# Altium project DM2097_R0M0E0.PrjPcb (part 2 of 4)

## Sheet DM2097_RJ45.SchDoc: =project_title
size Tabloid; CompanyName: Luxonis Holding; DrawnBy: David Malovrh; Organization: Luxonis Holding; Address1: 1925 Harmony Park Drive; Address2: Westminster, CO; Address3: 80234; Address4: United States; DocumentNumber: D0000200; Revision: R0M0E0; SheetNumber: 8; SheetTotal: 12
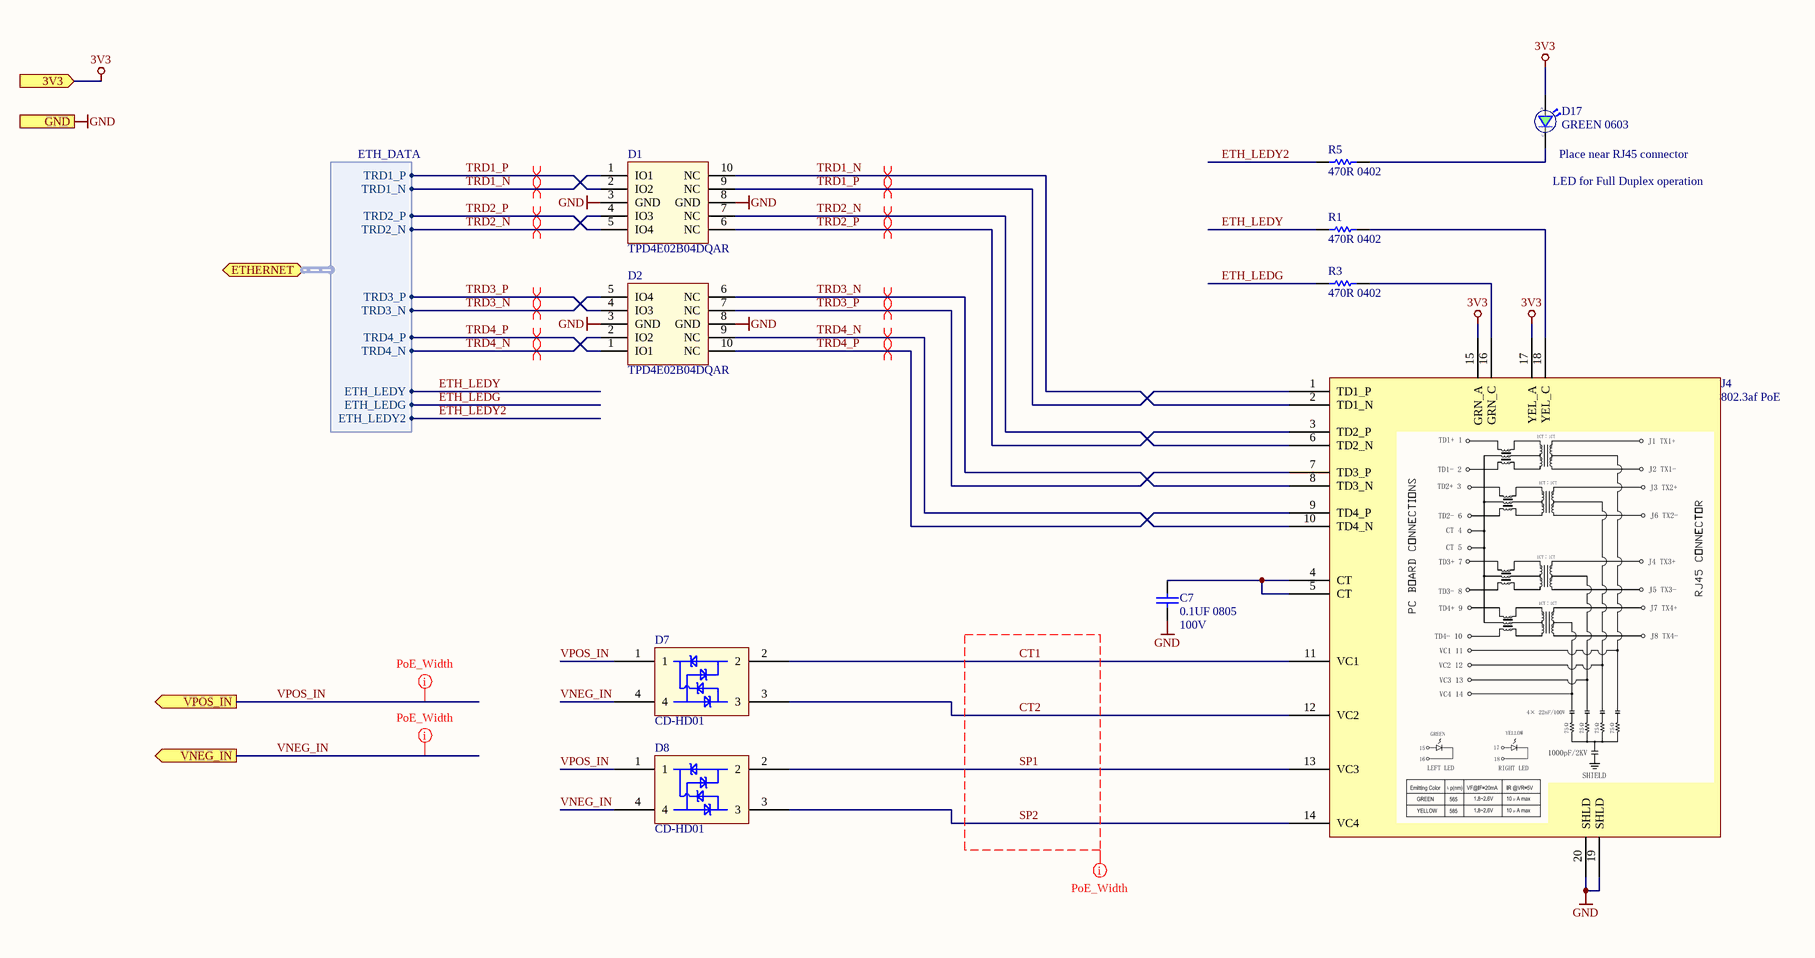
[diagram p3: DM2097_RJ45.SchDoc]

### Parts
C7  0.1UF 0805  Voltage Rating: 100V  [CAPC0805(2012)145_N]
D1  TPD4E02B04DQAR  [TPD4E02B04DQAR]
D2  TPD4E02B04DQAR  [TPD4E02B04DQAR]
D7  CD-HD01  [CD-H01]
D8  CD-HD01  [CD-H01]
D17  GREEN 0603  [SML_D1xx8W]
J4  802.3af PoE  [TRJG0926HENL]
R1  470R 0402  [RESC0402(1005)_N]
R3  470R 0402  [RESC0402(1005)_N]
R5  470R 0402  [RESC0402(1005)_N]

### Ports
3V3 (in), ETHERNET (bidir, harness ETH_DATA), GND (in), VNEG_IN (out), VPOS_IN (out)

### Harnesses
ETH_DATA: TRD1_P, TRD1_N, TRD2_P, TRD2_N, TRD3_P, TRD3_N, TRD4_P, TRD4_N, ETH_LEDG, ETH_LEDY, ETH_LEDY2

### Nets
3V3: D17.2(A) J4.15(GRN_A) J4.17(YEL_A) ; port 3V3
GND: C7.1 D1.3(GND) D1.8(GND) D2.3(GND) D2.8(GND) J4.19(SHLD) J4.20(SHLD) ; port GND
CT1: D7.2 J4.11(VC1)
CT2: D7.3 J4.12(VC2)
ETH_LEDG: R3.1 ; port ETHERNET.ETH_LEDG
ETH_LEDY: R1.1 ; port ETHERNET.ETH_LEDY
ETH_LEDY2: R5.1 ; port ETHERNET.ETH_LEDY2
SP1: D8.2 J4.13(VC3)
SP2: D8.3 J4.14(VC4)
TRD1_N: D1.1(IO1) D1.10(NC) J4.2(TD1_N) ; port ETHERNET.TRD1_N
TRD1_P: D1.2(IO2) D1.9(NC) J4.1(TD1_P) ; port ETHERNET.TRD1_P
TRD2_N: D1.4(IO3) D1.7(NC) J4.6(TD2_N) ; port ETHERNET.TRD2_N
TRD2_P: D1.5(IO4) D1.6(NC) J4.3(TD2_P) ; port ETHERNET.TRD2_P
TRD3_N: D2.5(IO4) D2.6(NC) J4.8(TD3_N) ; port ETHERNET.TRD3_N
TRD3_P: D2.4(IO3) D2.7(NC) J4.7(TD3_P) ; port ETHERNET.TRD3_P
TRD4_N: D2.2(IO2) D2.9(NC) J4.10(TD4_N) ; port ETHERNET.TRD4_N
TRD4_P: D2.1(IO1) D2.10(NC) J4.9(TD4_P) ; port ETHERNET.TRD4_P
VNEG_IN: D7.4 D8.4 ; port VNEG_IN
VPOS_IN: D7.1 D8.1 ; port VPOS_IN
NetC7_2: C7.2 J4.4(CT) J4.5(CT)
NetD17_1: D17.1(C) R5.2
NetJ4_16: J4.16(GRN_C) R3.2
NetJ4_18: J4.18(YEL_C) R1.2

### Layout directives
differential pair; net class ETH; differential pair class 100ohm: TRD1_N, TRD1_P, TRD2_N, TRD2_P, TRD3_N, TRD3_P, TRD4_N, TRD4_P
net class PoE_SELV: CT1, CT2, SP1, SP2
rule Width Constraint [Pref Width = 15mil    Min Width = 4mil    Max Width = 50mil]; net class PoE: VNEG_IN, VPOS_IN

### Notes on the sheet
- (near D17) Place near RJ45 connector
- (near D17) LED for Full Duplex operation
- Title
- Size:
- Date:
- Tabloid
- Number:
- Time:
- Revision:
- Sheet
- of
- Drawn by:

### Library data of the parts
C7 = CL21B104KCFNNNE: CAP CER 0.1UF 100V X7R 0805; Manufacturer 1: Samsung; Tolerance: 10%; Capacitance: 100nF; Supplier 1: Digi-Key; Manufacturer Part Number 1: CL21B104KCFNNNE; Stock 1: 93036; Pricing 1: 1=0.10000, 10=0.06800, 100=0.03050, 500=0.02180, 1000=0.01712 (USD); RoHS: Yes; Mount: Surface Mount; Case/Package: 0805; Case Code (Metric): 2012; Case Code (Imperial): 0805; Min Operating Temperature: -55°C; Max Operating Temperature: 125°C; Packaging: Tape and Reel; Dielectric: X7R; Length: 2mm; Width: 0.049inch; Thickness: 0.053inch; Depth: 1.25mm; Radiation Hardening: No; ComponentLink1URL: https://datasheet.ciiva.com/26936/getdatasheetpartid-781823-26936904.pdf?src-supplier=Verical; ComponentLink1Description: https://datasheet.ciiva.com/26936/getdatasheetpartid-781823-26936904.pdf?src-supplier=Verical; Supplier 2: Newark; Supplier 3: Future Electronics; Supplier Part Number 3: CL21B104KCFNNNE-CUTT; Supplier Part Number 2: 82AC9430; Supplier Part Number 1: 1276-6840-1-ND
D1 D2 = TPD4E02B04DQAR: TVS DIODE 3.6V 8.8V 10USON 8.8V (Typ) Clamp 5A (8/20µs) Ipp Tvs Diode Surface Mount 10-USON (2.5x1); Manufacturer 1: Texas Instruments; Number of Bidirectional Channels: 4; Min Breakdown Voltage: 5.5V; Peak Pulse Power: 17W; Power Line Protection: No; Interface: USB,HDMI; Supplier 1: Digi-Key; Manufacturer Part Number 1: TPD4E02B04DQAR; Stock 1: 25615; Pricing 1: 1=0.69000, 10=0.60800, 100=0.46650, 500=0.36874, 1000=0.29499 (USD); RoHS: Yes; Mount: Surface Mount; Number of Pins: 10; Min Operating Temperature: -40°C; Max Operating Temperature: 125°C; Packaging: Cut Tape; Reverse Standoff Voltage: 3.6V; Clamping Voltage: 8.8V; Operating Supply Voltage: 3.6V; Peak Pulse Current: 5A; Number of Channels: 4; Composition: Zener; REACH SVHC: No SVHC; Lead Free: Lead Free; ComponentLink1URL: http://www.ti.com/general/docs/lit/getliterature.tsp?genericPartNumber=TPD4E02B04&amp;&amp;fileType=pdf&src-supplier=Element14; ComponentLink1Description: http://www.ti.com/general/docs/lit/getliterature.tsp?genericPartNumber=TPD4E02B04&amp;&amp;fileType=pdf&src-supplier=Element14; ComponentLink2URL: http://www.ti.com/lit/ds/symlink/tpd4e02b04.pdf?src-supplier=Farnell; ComponentLink2Description: http://www.ti.com/lit/ds/symlink/tpd4e02b04.pdf?src-supplier=Farnell; ComponentLink3URL: http://www.ti.com/lit/ds/symlink/tpd4e02b04.pdf?src-supplier=Newark; ComponentLink3Description: http://www.ti.com/lit/ds/symlink/tpd4e02b04.pdf?src-supplier=Newark; ComponentLink4URL: http://www.ti.com/lit/ds/symlink/tpd4e02b04.pdf?src-supplier=Digi-Key; ComponentLink4Description: http://www.ti.com/lit/ds/symlink/tpd4e02b04.pdf?src-supplier=Digi-Key; Supplier Part Number 1: 296-43875-1-ND
D7 D8 = CD-HD01: CD-HD0x Series Schottky Bridge Rectifier Diode 100V 4-Pin Surface Mount T/R; Manufacturer 1: Bourns; Average Rectified Current: 1A; Supplier 1: Digi-Key; RoHS: No; Stock 1: 15383; Pricing 1: 1=0.61000, 10=0.52500, 100=0.36400, 500=0.28420, 1000=0.23100, 2000=0.21700 (USD); Mount: Surface Mount; Min Operating Temperature: -55°C; Max Operating Temperature: 125°C; Packaging: Tape and Reel; ComponentLink1URL: http://www.farnell.com/datasheets/2176057.pdf?src-supplier=Farnell; ComponentLink1Description: http://www.farnell.com/datasheets/2176057.pdf?src-supplier=Farnell; ComponentLink2URL: https://www.bourns.com/docs/Product-Datasheets/cd-hd0x.pdf?src-supplier=Digi-Key; ComponentLink2Description: https://www.bourns.com/docs/Product-Datasheets/cd-hd0x.pdf?src-supplier=Digi-Key; Supplier Part Number 1: CD-HD01CT-ND; Manufacturer Part Number 1: CD-HD01
D17 = SML-D12M8WT86: LED GREEN DIFFUSED 0603 SMD Green 572nm LED Indication - Discrete 2.2V 0603 (1608 Metric); Manufacturer: Rohm; Colour: Green,Yellow; Lens Colour: White,Clear,Diffused; Lens Style: Diffused,Colorless,Rectangular; Forward Current: 20mA; Luminous Intensity: 25mcd; Number of LEDs: 1; Viewing Angle: 160°; Lens Color: White,Diffused; Mount: Surface Mount; Case/Package: 0603; Number of Pins: 2; Case Code (Metric): 1608; Case Code (Imperial): 0603; Min Operating Temperature: -40°C; Max Operating Temperature: 85°C; Forward Voltage: 2.2V; Packaging: Tape and Reel; Dominant Wavelength: 572nm; Wavelength: 572nm; Illumination Colour: Green; Package Quantity: 1; Test Current: 20mA; Lens Transparency: Diffused; Length: 1.6mm; Height: 0.65mm; Width: 0.8mm; Radiation Hardening: No; REACH SVHC: Unknown; Lead Free: Lead Free; ComponentLink1URL: https://datasheet.ciiva.com/11774/0900766b80df3ada-11774260.pdf; ComponentLink1Description: https://datasheet.ciiva.com/11774/0900766b80df3ada-11774260.pdf; ComponentLink2URL: https://datasheet.ciiva.com/3161/sml-d1-3161419.pdf; ComponentLink2Description: https://datasheet.ciiva.com/3161/sml-d1-3161419.pdf; ComponentLink3URL: https://datasheet.ciiva.com/2110/sml-d1-2110396.pdf; ComponentLink3Description: https://datasheet.ciiva.com/2110/sml-d1-2110396.pdf; ComponentLink4URL: https://datasheet.ciiva.com/2110/sml-d1-2110397.pdf; ComponentLink4Description: https://datasheet.ciiva.com/2110/sml-d1-2110397.pdf; ComponentLink5URL: https://datasheet.ciiva.com/2110/sml-d1-2110398.pdf; ComponentLink5Description: https://datasheet.ciiva.com/2110/sml-d1-2110398.pdf; Manufacturer Part Number: SML-D12M8WT86; Supplier 1: Digi-Key; Manufacturer 1: Rohm; Manufacturer Part Number 1: SML-D12M8WT86; Stock 1: 112971; Pricing 1: 1=0.33000, 10=0.23900, 100=0.11340, 500=0.07560, 1000=0.05922 (USD); RoHS: Yes; Color: Green,Yellow; Illumination Color: Green; ComponentLink6URL: https://datasheet.ciiva.com/11774/0900766b80df3ada-11774260.pdf?src-supplier=RSComponents; ComponentLink6Description: https://datasheet.ciiva.com/11774/0900766b80df3ada-11774260.pdf?src-supplier=RSComponents; ComponentLink7URL: https://datasheet.ciiva.com/3161/sml-d1-3161419.pdf?src-supplier=Avnet; ComponentLink7Description: https://datasheet.ciiva.com/3161/sml-d1-3161419.pdf?src-supplier=Avnet; ComponentLink8URL: https://datasheet.ciiva.com/2110/sml-d1-2110396.pdf?src-supplier=Digi-Key; ComponentLink8Description: https://datasheet.ciiva.com/2110/sml-d1-2110396.pdf?src-supplier=Digi-Key; ComponentLink9URL: https://datasheet.ciiva.com/2110/sml-d1-2110397.pdf?src-supplier=Digi-Key; ComponentLink9Description: https://datasheet.ciiva.com/2110/sml-d1-2110397.pdf?src-supplier=Digi-Key; ComponentLink10URL: https://datasheet.ciiva.com/2110/sml-d1-2110398.pdf?src-supplier=Digi-Key; ComponentLink10Description: https://datasheet.ciiva.com/2110/sml-d1-2110398.pdf?src-supplier=Digi-Key; Supplier Part Number 1: 511-1578-1-ND
J4 = TRJG0926HENL: CONN MAGJACK 1PORT 1000 BASET; Manufacturer 1: Trxcom; System: Connector; Manufacturer Part Number 1: TRJG0926HENL; Supplier 1: Trxcom; Supplier Part Number 1: TRJG0926HENL
R1 R3 R5 = CRCW0402470RFKED: RES SMD 470 OHM 1% 1/16W 0402; Manufacturer 1: Vishay; Temperature Coefficient: 100ppm/°C; Power Rating: 63mW; Voltage Rating: 50V; Supplier 1: Digi-Key; Manufacturer Part Number 1: CRCW0402470RFKED; Stock 1: 9199; Pricing 1: 1=0.10000, 10=0.03800, 100=0.01540, 1000=0.00690, 2500=0.00599, 5000=0.00495 (USD); RoHS: Yes; Case/Package: 0402; Weight: 2.3E-05oz; Case Code (Imperial): 0402; Case Code (Metric): 1005; Min Operating Temperature: -55°C; Max Operating Temperature: 155°C; Packaging: Tape and Reel; Resistance: 470R; Tolerance: 1%; Composition: Thick Film; Voltage Rating (DC): 50V; Termination: SMD/SMT; Military Standard: Not; Length: 1mm; Height: 0.35mm; Width: 0.5mm; Depth: 0.5mm; Lead Free: Lead Free; ComponentLink1URL: https://datasheet.ciiva.com/11811/0900766b80d98824-11811416.pdf?src-supplier=RSComponents; ComponentLink1Description: https://datasheet.ciiva.com/11811/0900766b80d98824-11811416.pdf?src-supplier=RSComponents; Supplier 2: Newark; Supplier Part Number 1: 541-470LCT-ND; Supplier Part Number 2: 26W9133; Mount: Surface Mount; Contact Plating: Tin; Number of Terminations: 2; Package Quantity: 10; Max Power Dissipation: 63mW; Features: Automotive AEC-Q200; Radiation Hardening: No; REACH SVHC: Unknown; ComponentLink2URL: https://datasheet.ciiva.com/16764/70201119-16764886.pdf?src-supplier=Allied+Electronics; ComponentLink2Description: https://datasheet.ciiva.com/16764/70201119-16764886.pdf?src-supplier=Allied+Electronics; ComponentLink3URL: https://datasheet.ciiva.com/28613/1720486-28613479.pdf?src-supplier=Element14; ComponentLink3Description: https://datasheet.ciiva.com/28613/1720486-28613479.pdf?src-supplier=Element14; ComponentLink4URL: https://datasheet.ciiva.com/3256/dcrcwe3-3256553.pdf?src-supplier=Avnet; ComponentLink4Description: https://datasheet.ciiva.com/3256/dcrcwe3-3256553.pdf?src-supplier=Avnet; ComponentLink5URL: https://datasheet.ciiva.com/7777/1720486-7777243.pdf?src-supplier=Element14; ComponentLink5Description: https://datasheet.ciiva.com/7777/1720486-7777243.pdf?src-supplier=Element14; ComponentLink6URL: https://datasheet.ciiva.com/8336/dcrcwe3-8336715.pdf?src-supplier=Avnet; ComponentLink6Description: https://datasheet.ciiva.com/8336/dcrcwe3-8336715.pdf?src-supplier=Avnet; ComponentLink7URL: https://datasheet.ciiva.com/7777/1697337-7777244.pdf?src-supplier=Element14; ComponentLink7Description: https://datasheet.ciiva.com/7777/1697337-7777244.pdf?src-supplier=Element14; ComponentLink8URL: https://datasheet.ciiva.com/2463/dcrcwe3-2463085.pdf?src-supplier=Digi-Key; ComponentLink8Description: https://datasheet.ciiva.com/2463/dcrcwe3-2463085.pdf?src-supplier=Digi-Key; ComponentLink9URL: https://datasheet.ciiva.com/16362/dcrcwe3-16362109.pdf?src-supplier=Future+Electronics; ComponentLink9Description: https://datasheet.ciiva.com/16362/dcrcwe3-16362109.pdf?src-supplier=Future+Electronics; ComponentLink10URL: https://datasheet.ciiva.com/16882/dcrcwe3-16882493.pdf?src-supplier=Avnet+Europe; ComponentLink10Description: https://datasheet.ciiva.com/16882/dcrcwe3-16882493.pdf?src-supplier=Avnet+Europe; ComponentLink11URL: https://datasheet.ciiva.com/2463/dcrcwe3-2463086.pdf?src-supplier=Digi-Key; ComponentLink11Description: https://datasheet.ciiva.com/2463/dcrcwe3-2463086.pdf?src-supplier=Digi-Key; ComponentLink12URL: https://datasheet.ciiva.com/2463/dcrcwe3-2463087.pdf?src-supplier=Digi-Key; ComponentLink12Description: https://datasheet.ciiva.com/2463/dcrcwe3-2463087.pdf?src-supplier=Digi-Key

## Sheet DM2097_Power_Supply.SchDoc: =project_title
size Tabloid; PageSetup: Record=PageOptions|CenterHorizontal=True|CenterVertical=True|PrintScale=0.73|XCorrection=1.00|YCorrection=1.00|PrintKind=0|BorderSize=5000000|LeftOffset=0|BottomOffset=0|Orientation=2|PaperLength=1000|PaperWidth=1000|Scale=100|PaperSource=7|PrintQuality=-4|MediaType=1|DitherType=10|PaperKind=A4|PrintScaleMode=1; CompanyName: Luxonis Holding; DrawnBy: David Malovrh; Organization: Luxonis Holding; Address1: 1925 Harmony Park Drive; Address2: Westminster, CO; Address3: 80234; Address4: United States; DocumentNumber: D0000200; Revision: R0M0E0; SheetNumber: 7; SheetTotal: 17
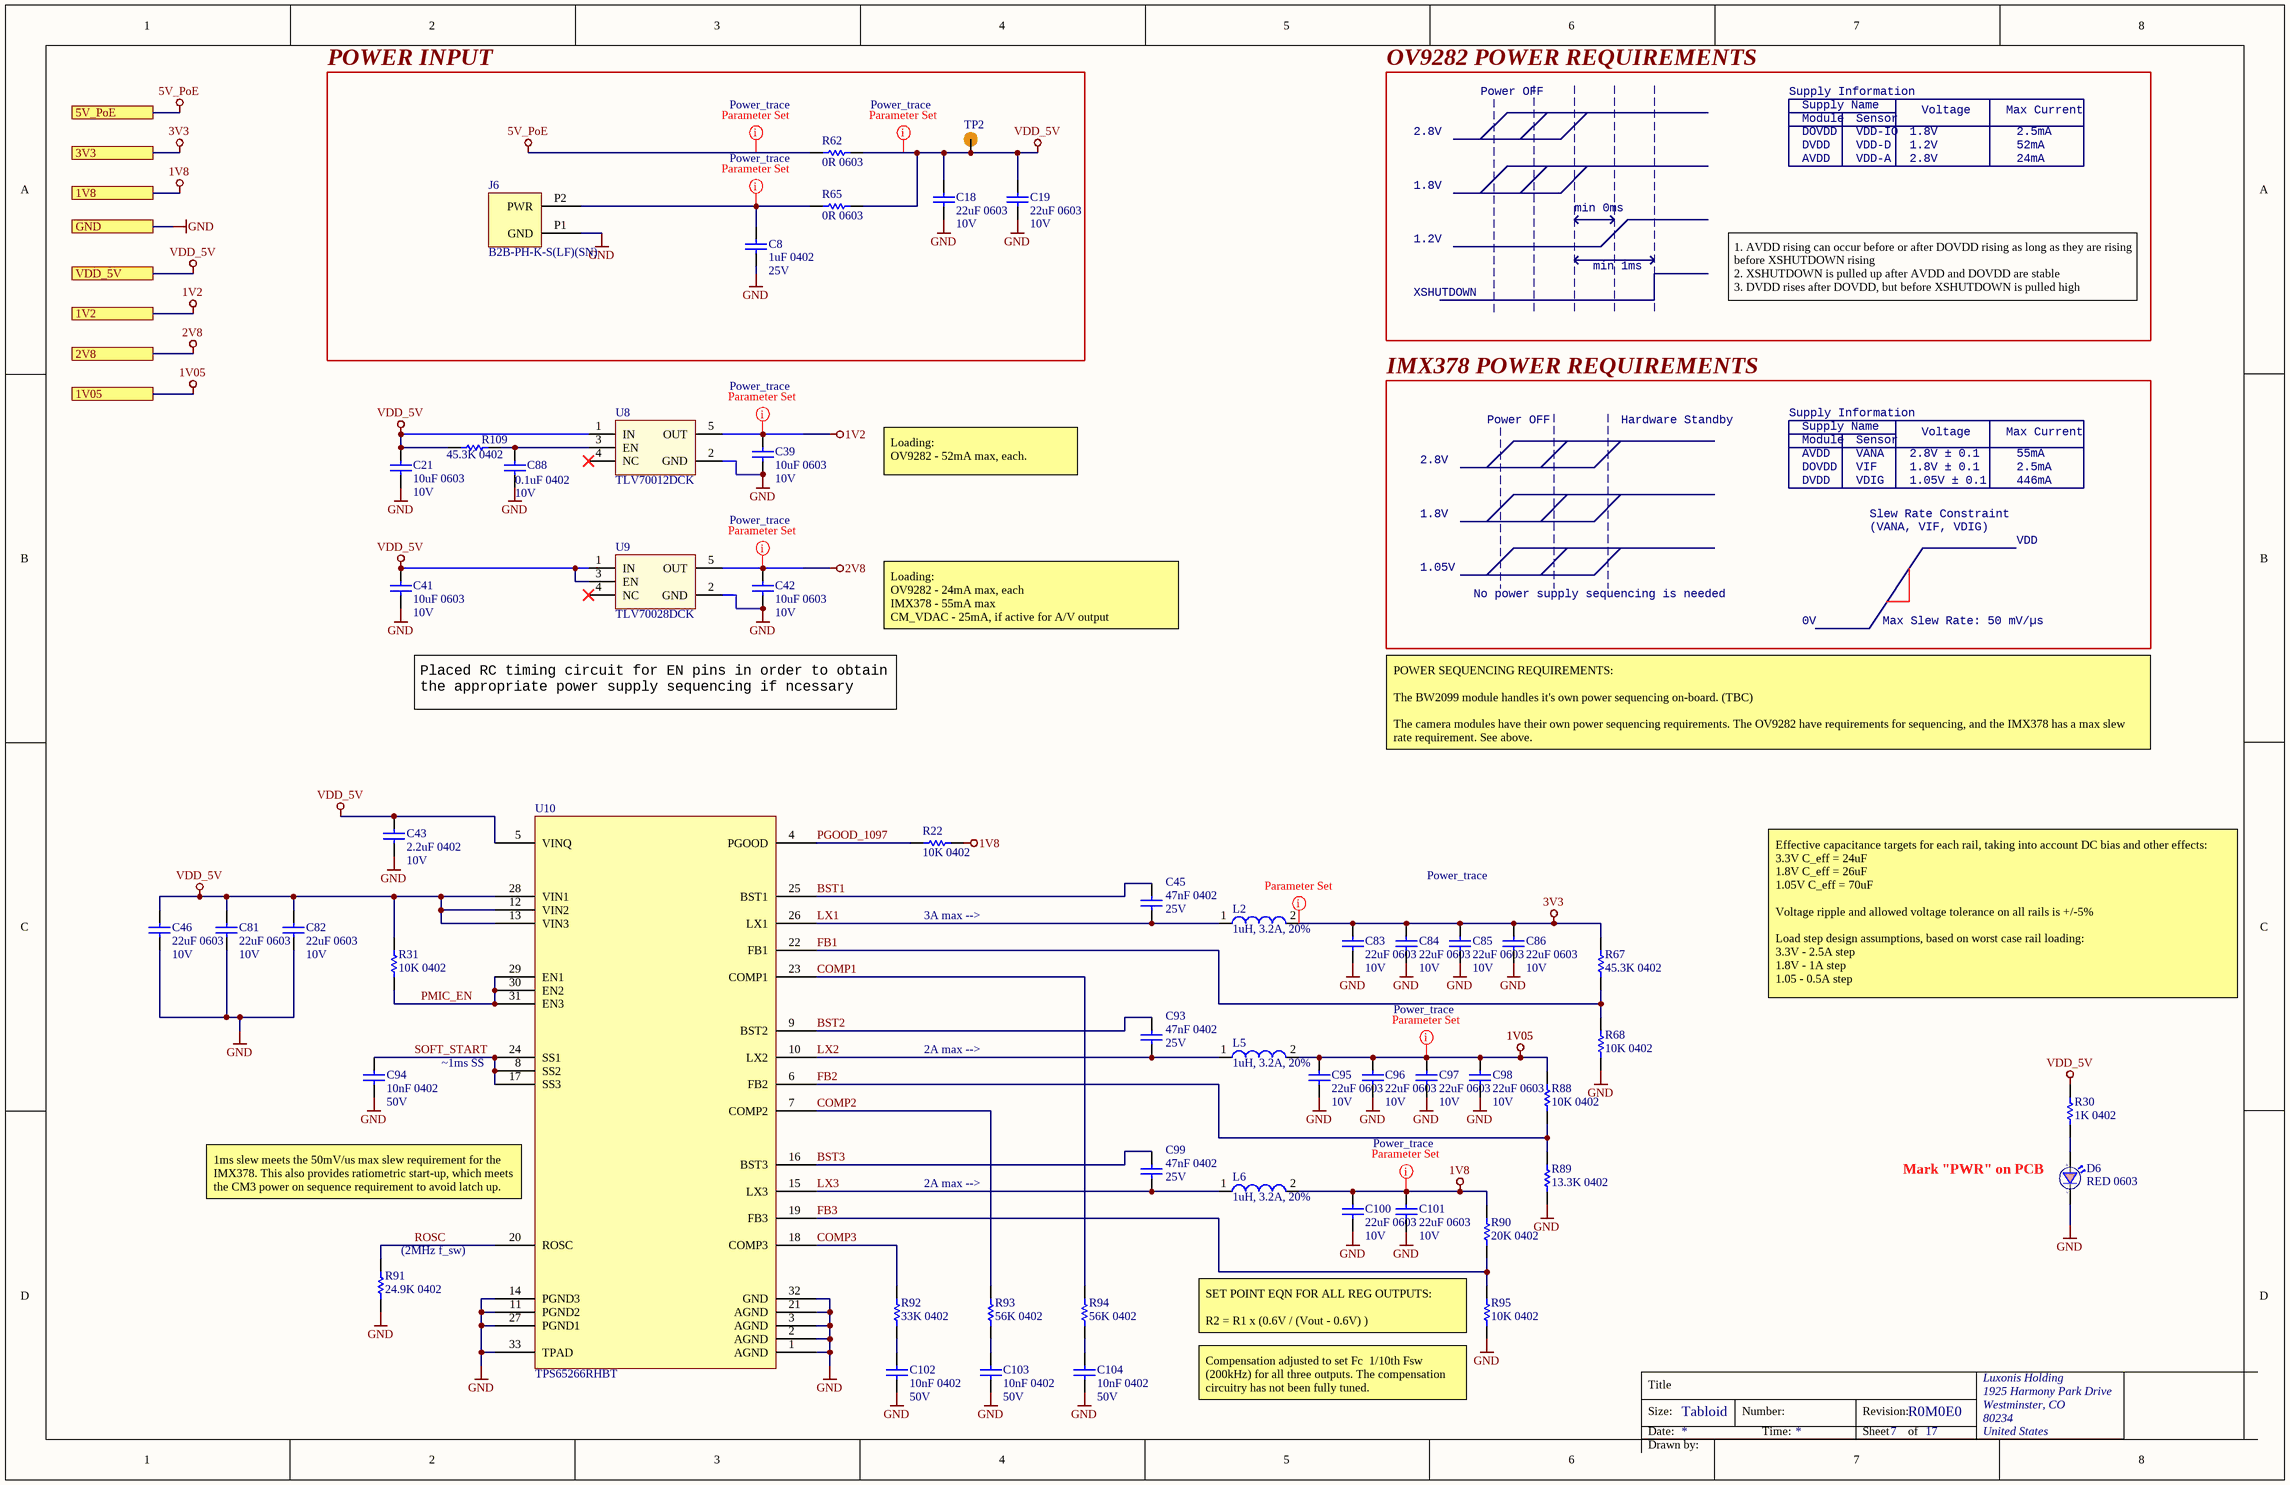
[diagram p4: DM2097_Power_Supply.SchDoc]

### Parts
C8  1uF 0402  Voltage Rating: 25V  [CAPC0402(1005)70_L]
C18  22uF 0603  Voltage Rating: 10V  [CAPC0603(1608)100_L]
C19  22uF 0603  Voltage Rating: 10V  [CAPC0603(1608)100_L]
C21  10uF 0603  Voltage Rating: 10V  [CAPC0603(1608)100_N]
C39  10uF 0603  Voltage Rating: 10V  [CAPC0603(1608)100_N]
C41  10uF 0603  Voltage Rating: 10V  [CAPC0603(1608)100_N]
C42  10uF 0603  Voltage Rating: 10V  [CAPC0603(1608)100_N]
C43  2.2uF 0402  Voltage Rating: 10V  [CAPC0402(1005)70_N]
C45  47nF 0402  Voltage: 25V  [CAPC0402(1005)70_N]
C46  22uF 0603  Voltage Rating: 10V  [CAPC0603(1608)100_N]
C81  22uF 0603  Voltage Rating: 10V  [CAPC0603(1608)100_N]
C82  22uF 0603  Voltage Rating: 10V  [CAPC0603(1608)100_N]
C83  22uF 0603  Voltage Rating: 10V  [CAPC0603(1608)100_N]
C84  22uF 0603  Voltage Rating: 10V  [CAPC0603(1608)100_N]
C85  22uF 0603  Voltage Rating: 10V  [CAPC0603(1608)100_N]
C86  22uF 0603  Voltage Rating: 10V  [CAPC0603(1608)100_N]
C88  0.1uF 0402  Voltage Rating: 10V  [CAPC0402(1005)70_L]
C93  47nF 0402  Voltage: 25V  [CAPC0402(1005)70_N]
C94  10nF 0402  Voltage Rating: 50V  [CAPC0402(1005)60_N]
C95  22uF 0603  Voltage Rating: 10V  [CAPC0603(1608)100_N]
C96  22uF 0603  Voltage Rating: 10V  [CAPC0603(1608)100_N]
C97  22uF 0603  Voltage Rating: 10V  [CAPC0603(1608)100_N]
C98  22uF 0603  Voltage Rating: 10V  [CAPC0603(1608)100_N]
C99  47nF 0402  Voltage: 25V  [CAPC0402(1005)70_N]
C100  22uF 0603  Voltage Rating: 10V  [CAPC0603(1608)100_N]
C101  22uF 0603  Voltage Rating: 10V  [CAPC0603(1608)100_N]
C102  10nF 0402  Voltage Rating: 50V  [CAPC0402(1005)60_N]
C103  10nF 0402  Voltage Rating: 50V  [CAPC0402(1005)60_N]
C104  10nF 0402  Voltage Rating: 50V  [CAPC0402(1005)60_N]
D6  RED 0603  [SML_D1xx8W]
J6  B2B-PH-K-S(LF)(SN)  [B2B-PH-K-S(LF)(SN)]
L2  1uH, 3.2A, 20%  [DFE252012P-1R0M=P2]
L5  1uH, 3.2A, 20%  [DFE252012P-1R0M=P2]
L6  1uH, 3.2A, 20%  [DFE252012P-1R0M=P2]
R22  10K 0402  [RESC0402(1005)_N]
R30  1K 0402  [RESC0402(1005)_N]
R31  10K 0402  [RESC0402(1005)_N]
R62  0R 0603  [RESC0603(1608)_N]
R65  0R 0603  [RESC0603(1608)_N]
R67  45.3K 0402  [RESC0402(1005)_N]
R68  10K 0402  [RESC0402(1005)_N]
R88  10K 0402  [RESC0402(1005)_N]
R89  13.3K 0402  [RESC0402(1005)_N]
R90  20K 0402  [RESC0402(1005)_N]
R91  24.9K 0402  [RESC0402(1005)_N]
R92  33K 0402  [RESC0402(1005)_N]
R93  56K 0402  [RESC0402(1005)_N]
R94  56K 0402  [RESC0402(1005)_N]
R95  10K 0402  [RESC0402(1005)_N]
R109  45.3K 0402  [RESC0402(1005)_L]
TP2  TP100_200_NS  [TP100_200_NS]  (value not drawn)  (no BOM)
U8  TLV70012DCK  [TLV70012DCK]
U9  TLV70028DCK  [TLV70028DCK]
U10  TPS65266RHBT  [TPS65266RHBT]

### Blocks framed on the sheet
POWER INPUT: C8 C18 C19 J6 R62 R65 TP2

### Ports
1V2, 1V05, 1V8, 2V8, 3V3, 5V_PoE, GND, VDD_5V

### Nets
1V2: C39.2 U8.5(OUT) ; port 1V2
1V05: C95.1 C96.1 C97.1 C98.1 L5.2 R88.2 ; port 1V05
1V8: C100.1 C101.1 L6.2 R22.2 R90.2 ; port 1V8
2V8: C42.2 U9.5(OUT) ; port 2V8
3V3: C83.1 C84.1 C85.1 C86.1 L2.2 R67.2 ; port 3V3
5V_PoE: R62.1 ; port 5V_PoE
GND: C8.1 C18.1 C19.1 C21.1 C39.1 C41.1 C42.1 C43.2 C46.2 C81.2 C82.2 C83.2 C84.2 C85.2 C86.2 C88.1 C94.2 C95.2 C96.2 C97.2 C98.2 C100.2 C101.2 C102.2 C103.2 C104.2 D6.1(C) J6.P1(GND) R68.1 R89.1 R91.1 R95.1 U8.2(GND) U9.2(GND) U10.1(AGND) U10.2(AGND) U10.3(AGND) U10.11(PGND2) U10.14(PGND3) U10.21(AGND) U10.27(PGND1) U10.32(GND) U10.33(TPAD) ; port GND
VDD_5V: C18.2 C19.2 C21.2 C41.2 C43.1 C46.1 C81.1 C82.1 R30.2 R31.2 R62.2 R65.2 R109.2 TP2.1 U8.1(IN) U9.1(IN) U9.3(EN) U10.5(VINQ) U10.12(VIN2) U10.13(VIN3) U10.28(VIN1) ; port VDD_5V
BST1: C45.1 U10.25(BST1)
BST2: C93.1 U10.9(BST2)
BST3: C99.1 U10.16(BST3)
COMP1: R94.2 U10.23(COMP1)
COMP2: R93.2 U10.7(COMP2)
COMP3: R92.2 U10.18(COMP3)
FB1: R67.1 R68.2 U10.22(FB1)
FB2: R88.1 R89.2 U10.6(FB2)
FB3: R90.1 R95.2 U10.19(FB3)
LX1: C45.2 L2.1 U10.26(LX1)
LX2: C93.2 L5.1 U10.10(LX2)
LX3: C99.2 L6.1 U10.15(LX3)
PGOOD_1097: R22.1 U10.4(PGOOD)
PMIC_EN: R31.1 U10.29(EN1) U10.30(EN2) U10.31(EN3)
ROSC: R91.2 U10.20(ROSC)
SOFT_START: C94.1 U10.8(SS2) U10.17(SS3) U10.24(SS1)
NetC8_2: C8.2 J6.P2(PWR) R65.1
NetC88_2: C88.2 R109.1 U8.3(EN)
NetC102_1: C102.1 R92.1
NetC103_1: C103.1 R93.1
NetC104_1: C104.1 R94.1
NetD6_2: D6.2(A) R30.1

Not connected (* = marked no-connect by the designer): U8 4(NC)*; U9 4(NC)*

### Layout directives
net class Power_trace: 1V2, 1V05, 1V8, 2V8, 3V3, 5V_PoE, NetC8_2, VDD_5V

### Notes on the sheet
- OV9282 POWER REQUIREMENTS
- Power OFF
- Supply Information
- 2.8V
- AVDD
- DOVDD
- DVDD
- Supply Name
- Module
- VDD-A
- VDD-IO
- VDD-D
- Sensor
- 1.8V
- 1.2V
- Voltage
- Max Current
- 24mA
- 2.5mA
- 52mA
- min 0ms
- XSHUTDOWN
- min 1ms
- 1. AVDD rising can occur before or after DOVDD rising as long as they are rising before XSHUTDOWN rising
  2. XSHUTDOWN is pulled up after AVDD and DOVDD are stable
  3. DVDD rises after DOVDD, but before XSHUTDOWN is pulled high
- IMX378 POWER REQUIREMENTS
- Hardware Standby
- Loading:
  OV9282 - 52mA max, each.
- VANA
- VIF
- VDIG
- 2.8V ± 0.1
- 1.8V ± 0.1
- 1.05V ± 0.1
- 55mA
- 446mA
- 1.05V
- Slew Rate Constraint
- (VANA, VIF, VDIG)
- VDD
- Loading:
  OV9282 - 24mA max, each
  IMX378 - 55mA max
  CM_VDAC - 25mA, if active for A/V output
- No power supply sequencing is needed
- 0V
- Max Slew Rate: 50 mV/µs
- Placed RC timing circuit for EN pins in order to obtain the appropriate power supply sequencing if ncessary
- POWER SEQUENCING REQUIREMENTS:
  The BW2099 module handles it's own power sequencing on-board. (TBC)
  The camera modules have their own power sequencing requirements. The OV9282 have requirements for sequencing, and the IMX378 has a max slew rate requirement. See above.
- 3A max -->
- Effective capacitance targets for each rail, taking into account DC bias and other effects:
  3.3V C_eff = 24uF
  1.8V C_eff = 26uF
  1.05V C_eff = 70uF
  Voltage ripple and allowed voltage tolerance on all rails is +/-5%
  Load step design assumptions, based on worst case rail loading:
  3.3V - 2.5A step
  1.8V - 1A step
  1.05 - 0.5A step
- ~1ms SS
- 2A max -->
- (near U10) 1ms slew meets the 50mV/us max slew requirement for the IMX378. This also provides ratiometric start-up, which meets the CM3 power on sequence requirement to avoid latch up.
- Mark "PWR" on PCB
- (near R91) (2MHz f_sw)
- (near R95) SET POINT EQN FOR ALL REG OUTPUTS:
  R2 = R1 x (0.6V / (Vout - 0.6V) )
- (near R95) Compensation adjusted to set Fc  1/10th Fsw  (200kHz) for all three outputs. The compensation circuitry has not been fully tuned.
- Title
- Size:
- Date:
- Tabloid
- Number:
- Time:
- Revision:
- Sheet
- of
- Drawn by: